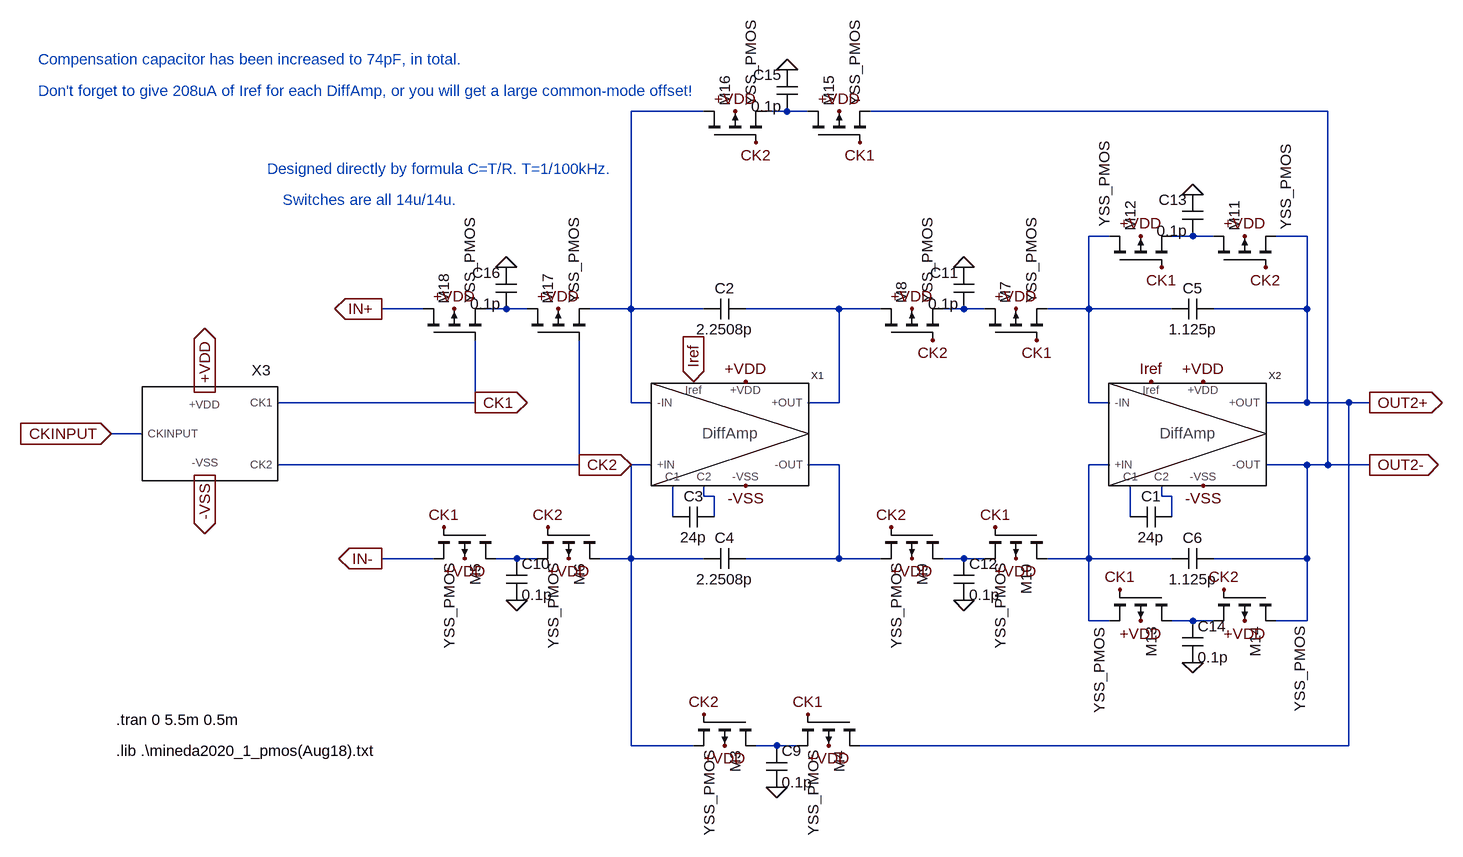
[diagram p0: schematic SCF-Biquad-Final_symbol.asc]
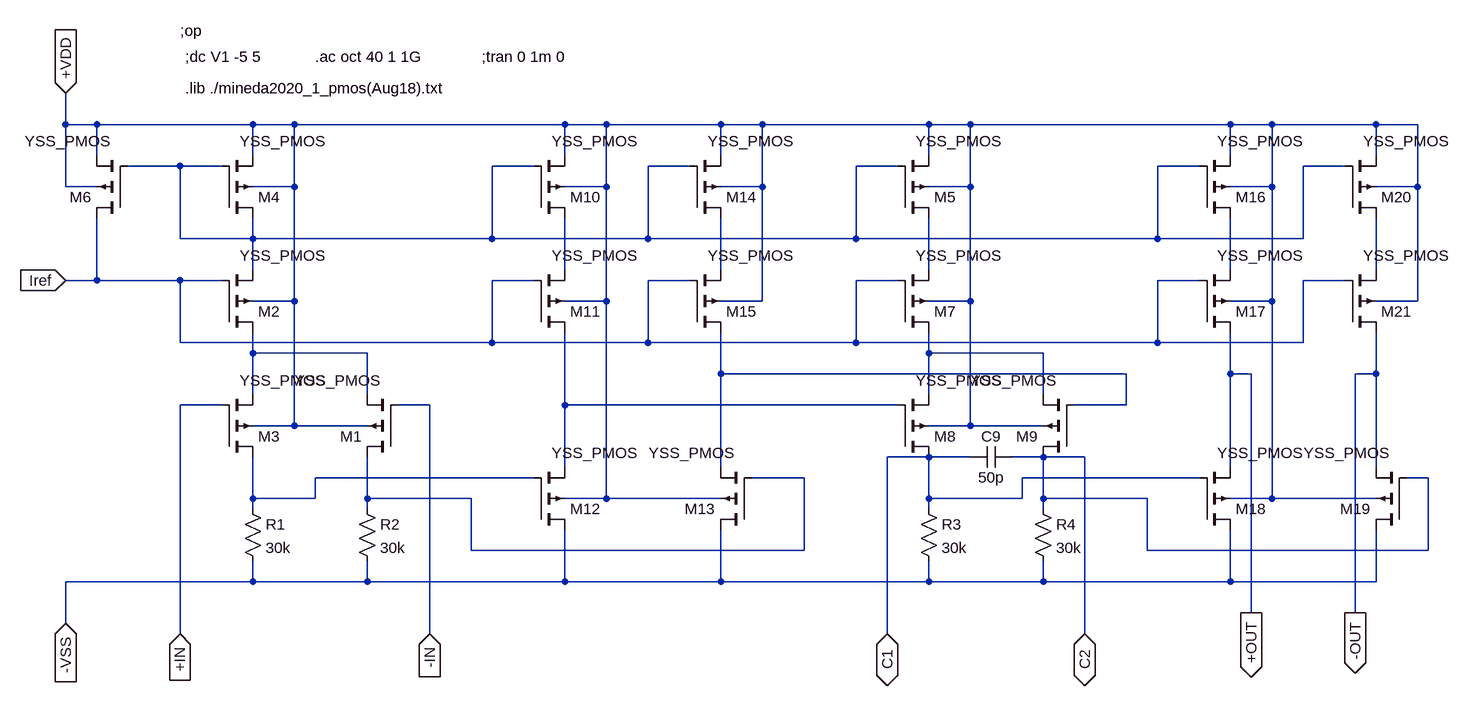
[diagram p1: sub-circuit diffamp.asc]
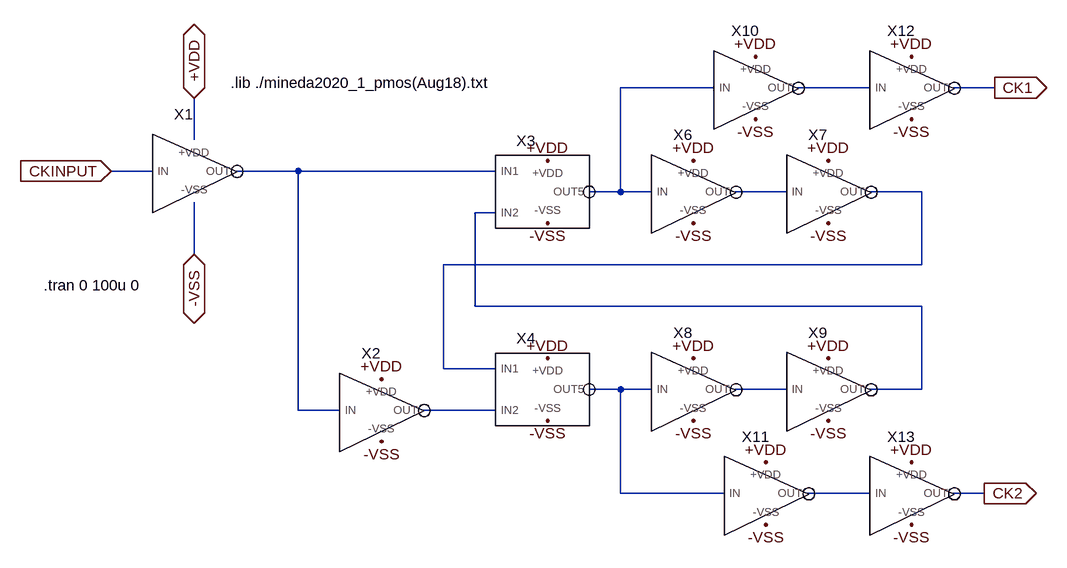
[diagram p2: sub-circuit non-overlapping-ckgen.asc]
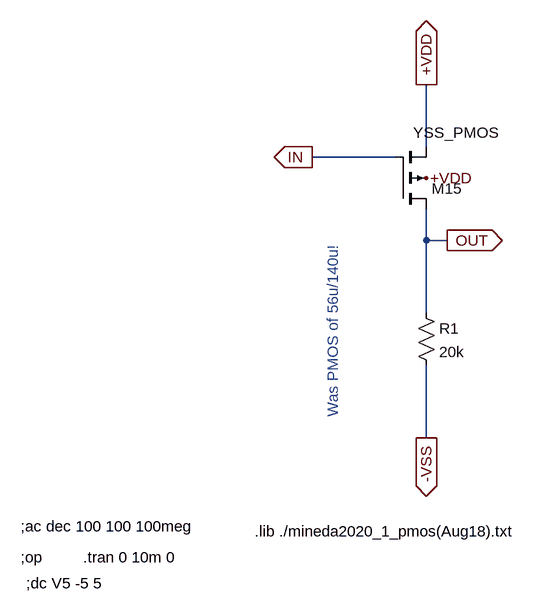
[diagram p3: sub-circuit pmos-inv.asc]
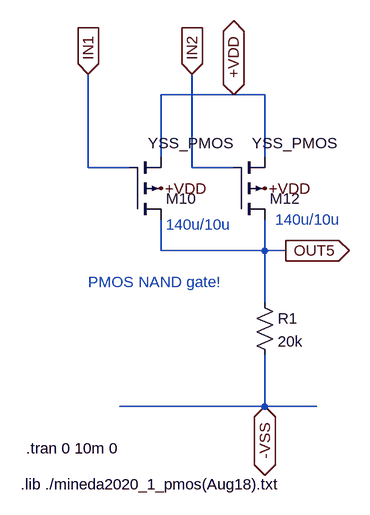
[diagram p4: sub-circuit pmos-nor.asc]
SCF-Biquad-Final_symbol.asc, the LTspice schematic file:
Version 4
SHEET 1 2296 2968
WIRE 576 -976 464 -976
WIRE 704 -976 672 -976
WIRE 736 -976 704 -976
WIRE 1536 -976 832 -976
WIRE 1200 -784 1168 -784
WIRE 1328 -784 1296 -784
WIRE 1360 -784 1328 -784
WIRE 1504 -784 1456 -784
WIRE 144 -672 80 -672
WIRE 272 -672 240 -672
WIRE 304 -672 272 -672
WIRE 464 -672 464 -976
WIRE 464 -672 400 -672
WIRE 576 -672 464 -672
WIRE 784 -672 640 -672
WIRE 848 -672 784 -672
WIRE 976 -672 944 -672
WIRE 1008 -672 976 -672
WIRE 1168 -672 1168 -784
WIRE 1168 -672 1104 -672
WIRE 1296 -672 1168 -672
WIRE 1504 -672 1504 -784
WIRE 1504 -672 1360 -672
WIRE 224 -528 224 -624
WIRE 224 -528 -80 -528
WIRE 464 -528 464 -672
WIRE 496 -528 464 -528
WIRE 784 -528 784 -672
WIRE 784 -528 736 -528
WIRE 1168 -528 1168 -672
WIRE 1200 -528 1168 -528
WIRE 1504 -528 1504 -672
WIRE 1504 -528 1440 -528
WIRE 1568 -528 1504 -528
WIRE 1600 -528 1568 -528
WIRE -288 -480 -336 -480
WIRE 384 -432 384 -624
WIRE 384 -432 -80 -432
WIRE 496 -432 464 -432
WIRE 784 -432 736 -432
WIRE 1200 -432 1168 -432
WIRE 1504 -432 1440 -432
WIRE 1536 -432 1536 -976
WIRE 1536 -432 1504 -432
WIRE 1600 -432 1536 -432
WIRE 576 -384 576 -400
WIRE 592 -384 576 -384
WIRE 1280 -384 1280 -400
WIRE 1296 -384 1280 -384
WIRE 528 -352 528 -400
WIRE 592 -352 592 -384
WIRE 1232 -352 1232 -400
WIRE 1296 -352 1296 -384
WIRE 160 -288 80 -288
WIRE 288 -288 256 -288
WIRE 320 -288 288 -288
WIRE 464 -288 464 -432
WIRE 464 -288 416 -288
WIRE 576 -288 464 -288
WIRE 784 -288 784 -432
WIRE 784 -288 640 -288
WIRE 848 -288 784 -288
WIRE 976 -288 944 -288
WIRE 1008 -288 976 -288
WIRE 1168 -288 1168 -432
WIRE 1168 -288 1104 -288
WIRE 1296 -288 1168 -288
WIRE 1504 -288 1504 -432
WIRE 1504 -288 1360 -288
WIRE 1168 -192 1168 -288
WIRE 1200 -192 1168 -192
WIRE 1328 -192 1296 -192
WIRE 1360 -192 1328 -192
WIRE 1504 -192 1504 -288
WIRE 1504 -192 1456 -192
WIRE 464 0 464 -288
WIRE 560 0 464 0
WIRE 688 0 656 0
WIRE 720 0 688 0
WIRE 1568 0 1568 -528
WIRE 1568 0 816 0
FLAG 640 -560 +VDD
FLAG 640 -400 -VSS
FLAG 560 -560 Iref
IOPIN 560 -560 In
FLAG 1344 -560 +VDD
FLAG 1344 -400 -VSS
FLAG 1264 -560 Iref
FLAG 1600 -528 OUT2+
IOPIN 1600 -528 Out
FLAG 1600 -432 OUT2-
IOPIN 1600 -432 Out
FLAG 688 64 0
FLAG 608 0 +VDD
FLAG 768 0 +VDD
FLAG 576 -48 CK2
FLAG 736 -48 CK1
FLAG 288 -224 0
FLAG 208 -288 +VDD
FLAG 368 -288 +VDD
FLAG 176 -336 CK1
FLAG 336 -336 CK2
FLAG 976 -736 0
FLAG 1056 -672 +VDD
FLAG 896 -672 +VDD
FLAG 1088 -624 CK1
FLAG 928 -624 CK2
FLAG 976 -224 0
FLAG 896 -288 +VDD
FLAG 1056 -288 +VDD
FLAG 864 -336 CK2
FLAG 1024 -336 CK1
FLAG 1328 -848 0
FLAG 1408 -784 +VDD
FLAG 1248 -784 +VDD
FLAG 1440 -736 CK2
FLAG 1280 -736 CK1
FLAG 1328 -128 0
FLAG 1248 -192 +VDD
FLAG 1408 -192 +VDD
FLAG 1216 -240 CK1
FLAG 1376 -240 CK2
FLAG 704 -1040 0
FLAG 784 -976 +VDD
FLAG 624 -976 +VDD
FLAG 816 -928 CK1
FLAG 656 -928 CK2
FLAG 272 -736 0
FLAG 352 -672 +VDD
FLAG 192 -672 +VDD
FLAG 384 -432 CK2
IOPIN 384 -432 Out
FLAG 224 -528 CK1
IOPIN 224 -528 Out
FLAG 80 -672 IN+
IOPIN 80 -672 Out
FLAG 80 -288 IN-
IOPIN 80 -288 Out
FLAG -192 -544 +VDD
IOPIN -192 -544 Out
FLAG -192 -416 -VSS
IOPIN -192 -416 Out
FLAG -336 -480 CKINPUT
IOPIN -336 -480 In
SYMBOL cap 592 -368 R90
WINDOW 0 0 32 VBottom 2
WINDOW 3 32 32 VTop 2
SYMATTR InstName C3
SYMATTR Value 24p
SYMBOL DiffAmp 560 -480 R0
SYMATTR InstName X1
SYMBOL cap 1296 -368 R90
WINDOW 0 0 32 VBottom 2
WINDOW 3 32 32 VTop 2
SYMATTR InstName C1
SYMATTR Value 24p
SYMBOL DiffAmp 1264 -480 R0
SYMATTR InstName X2
SYMBOL cap 640 -688 R90
WINDOW 0 0 32 VBottom 2
WINDOW 3 32 32 VTop 2
SYMATTR InstName C2
SYMATTR Value 2.2508p
SYMBOL cap 640 -304 R90
WINDOW 0 0 32 VBottom 2
WINDOW 3 32 32 VTop 2
SYMATTR InstName C4
SYMATTR Value 2.2508p
SYMBOL cap 1360 -688 R90
WINDOW 0 0 32 VBottom 2
WINDOW 3 32 32 VTop 2
SYMATTR InstName C5
SYMATTR Value 1.125p
SYMBOL cap 1360 -304 R90
WINDOW 0 0 32 VBottom 2
WINDOW 3 32 32 VTop 2
SYMATTR InstName C6
SYMATTR Value 1.125p
SYMBOL pmos4 656 -48 R90
SYMATTR InstName M3
SYMATTR Value YSS_PMOS
SYMATTR Value2 l=14u w=14u
SYMBOL pmos4 816 -48 R90
SYMATTR InstName M4
SYMATTR Value YSS_PMOS
SYMATTR Value2 l=14u w=14u
SYMBOL cap 672 0 R0
SYMATTR InstName C9
SYMATTR Value 0.1p
SYMBOL pmos4 256 -336 R90
SYMATTR InstName M5
SYMATTR Value YSS_PMOS
SYMATTR Value2 l=14u w=14u
SYMBOL pmos4 416 -336 R90
SYMATTR InstName M6
SYMATTR Value YSS_PMOS
SYMATTR Value2 l=14u w=14u
SYMBOL cap 272 -288 R0
SYMATTR InstName C10
SYMATTR Value 0.1p
SYMBOL pmos4 1008 -624 R270
SYMATTR InstName M7
SYMATTR Value YSS_PMOS
SYMATTR Value2 l=14u w=14u
SYMBOL pmos4 848 -624 R270
SYMATTR InstName M8
SYMATTR Value YSS_PMOS
SYMATTR Value2 l=14u w=14u
SYMBOL cap 992 -672 R180
WINDOW 0 24 56 Left 2
WINDOW 3 24 8 Left 2
SYMATTR InstName C11
SYMATTR Value 0.1p
SYMBOL pmos4 944 -336 R90
SYMATTR InstName M9
SYMATTR Value YSS_PMOS
SYMATTR Value2 l=14u w=14u
SYMBOL pmos4 1104 -336 R90
SYMATTR InstName M10
SYMATTR Value YSS_PMOS
SYMATTR Value2 l=14u w=14u
SYMBOL cap 960 -288 R0
SYMATTR InstName C12
SYMATTR Value 0.1p
SYMBOL pmos4 1360 -736 R270
WINDOW 3 57 111 Left 2
SYMATTR Value YSS_PMOS
SYMATTR InstName M11
SYMATTR Value2 l=14u w=14u
SYMBOL pmos4 1200 -736 R270
WINDOW 3 62 -8 Left 2
SYMATTR Value YSS_PMOS
SYMATTR InstName M12
SYMATTR Value2 l=14u w=14u
SYMBOL cap 1344 -784 R180
WINDOW 0 24 56 Left 2
WINDOW 3 24 8 Left 2
SYMATTR InstName C13
SYMATTR Value 0.1p
SYMBOL pmos4 1296 -240 R90
WINDOW 3 59 112 Left 2
SYMATTR Value YSS_PMOS
SYMATTR InstName M13
SYMATTR Value2 l=14u w=14u
SYMBOL pmos4 1456 -240 R90
WINDOW 3 57 -37 Left 2
SYMATTR Value YSS_PMOS
SYMATTR InstName M14
SYMATTR Value2 l=14u w=14u
SYMBOL cap 1312 -192 R0
SYMATTR InstName C14
SYMATTR Value 0.1p
SYMBOL pmos4 736 -928 R270
SYMATTR InstName M15
SYMATTR Value YSS_PMOS
SYMATTR Value2 l=14u w=14u
SYMBOL pmos4 576 -928 R270
SYMATTR InstName M16
SYMATTR Value YSS_PMOS
SYMATTR Value2 l=14u w=14u
SYMBOL cap 720 -976 R180
WINDOW 0 24 56 Left 2
WINDOW 3 24 8 Left 2
SYMATTR InstName C15
SYMATTR Value 0.1p
SYMBOL pmos4 304 -624 R270
SYMATTR InstName M17
SYMATTR Value YSS_PMOS
SYMATTR Value2 l=14u w=14u
SYMBOL pmos4 144 -624 R270
SYMATTR InstName M18
SYMATTR Value YSS_PMOS
SYMATTR Value2 l=14u w=14u
SYMBOL cap 288 -672 R180
WINDOW 0 24 56 Left 2
WINDOW 3 24 8 Left 2
SYMATTR InstName C16
SYMATTR Value 0.1p
SYMBOL Non-overlapping-CKGen -192 -480 R0
SYMATTR InstName X3
TEXT -328 8 Left 2 !.lib .\\mineda2020_1_pmos(Aug18).txt
TEXT -328 -40 Left 2 !.tran 0 5.5m 0.5m
TEXT -448 -1056 Left 2 ;Compensation capacitor has been increased to 74pF, in total.
TEXT -448 -1008 Left 2 ;Don't forget to give 208uA of Iref for each DiffAmp, or you will get a large common-mode offset!
TEXT -96 -888 Left 2 ;Designed directly by formula C=T/R. T=1/100kHz.
TEXT -72 -840 Left 2 ;Switches are all 14u/14u.

diffamp.asc, the sub-circuit schematic file:
Version 4
SHEET 1 2296 2968
WIRE -384 -864 -384 -912
WIRE -336 -864 -384 -864
WIRE -96 -864 -336 -864
WIRE -32 -864 -96 -864
WIRE 384 -864 -32 -864
WIRE 448 -864 384 -864
WIRE 624 -864 448 -864
WIRE 688 -864 624 -864
WIRE 944 -864 688 -864
WIRE 1008 -864 944 -864
WIRE 1408 -864 1008 -864
WIRE 1472 -864 1408 -864
WIRE 1632 -864 1472 -864
WIRE 1696 -864 1632 -864
WIRE -336 -816 -336 -864
WIRE -96 -816 -96 -864
WIRE 384 -816 384 -864
WIRE 624 -816 624 -864
WIRE 944 -816 944 -864
WIRE 1408 -816 1408 -864
WIRE 1632 -816 1632 -864
WIRE -208 -800 -288 -800
WIRE -144 -800 -208 -800
WIRE 336 -800 272 -800
WIRE 576 -800 512 -800
WIRE 896 -800 832 -800
WIRE 1360 -800 1296 -800
WIRE 1584 -800 1520 -800
WIRE -384 -768 -384 -864
WIRE -336 -768 -384 -768
WIRE -32 -768 -32 -864
WIRE -32 -768 -96 -768
WIRE 448 -768 448 -864
WIRE 448 -768 384 -768
WIRE 688 -768 688 -864
WIRE 688 -768 624 -768
WIRE 1008 -768 1008 -864
WIRE 1008 -768 944 -768
WIRE 1472 -768 1472 -864
WIRE 1472 -768 1408 -768
WIRE 1696 -768 1696 -864
WIRE 1696 -768 1632 -768
WIRE -208 -688 -208 -800
WIRE -96 -688 -96 -720
WIRE -96 -688 -208 -688
WIRE 272 -688 272 -800
WIRE 272 -688 -96 -688
WIRE 512 -688 512 -800
WIRE 512 -688 272 -688
WIRE 832 -688 832 -800
WIRE 832 -688 512 -688
WIRE 1296 -688 1296 -800
WIRE 1296 -688 832 -688
WIRE 1520 -688 1520 -800
WIRE 1520 -688 1296 -688
WIRE -96 -640 -96 -688
WIRE 384 -640 384 -720
WIRE 624 -640 624 -720
WIRE 944 -640 944 -720
WIRE 1408 -640 1408 -720
WIRE 1632 -640 1632 -720
WIRE -336 -624 -336 -720
WIRE -336 -624 -384 -624
WIRE -208 -624 -336 -624
WIRE -144 -624 -208 -624
WIRE 336 -624 272 -624
WIRE 576 -624 512 -624
WIRE 896 -624 832 -624
WIRE 1360 -624 1296 -624
WIRE 1584 -624 1520 -624
WIRE -32 -592 -32 -768
WIRE -32 -592 -96 -592
WIRE 448 -592 448 -768
WIRE 448 -592 384 -592
WIRE 688 -592 688 -768
WIRE 688 -592 624 -592
WIRE 1008 -592 1008 -768
WIRE 1008 -592 944 -592
WIRE 1472 -592 1472 -768
WIRE 1472 -592 1408 -592
WIRE 1696 -592 1696 -768
WIRE 1696 -592 1632 -592
WIRE -208 -528 -208 -624
WIRE 272 -528 272 -624
WIRE 272 -528 -208 -528
WIRE 512 -528 512 -624
WIRE 512 -528 272 -528
WIRE 832 -528 832 -624
WIRE 832 -528 512 -528
WIRE 1296 -528 1296 -624
WIRE 1296 -528 832 -528
WIRE 1520 -528 1520 -624
WIRE 1520 -528 1296 -528
WIRE -96 -512 -96 -544
WIRE 80 -512 -96 -512
WIRE 944 -512 944 -544
WIRE 1120 -512 944 -512
WIRE 624 -480 624 -544
WIRE 1248 -480 624 -480
WIRE 1408 -480 1408 -544
WIRE 1440 -480 1408 -480
WIRE 1632 -480 1632 -544
WIRE 1632 -480 1600 -480
WIRE -96 -448 -96 -512
WIRE 80 -448 80 -512
WIRE 944 -448 944 -512
WIRE 1120 -448 1120 -512
WIRE -144 -432 -208 -432
WIRE 176 -432 128 -432
WIRE 384 -432 384 -544
WIRE 896 -432 384 -432
WIRE 1248 -432 1248 -480
WIRE 1248 -432 1168 -432
WIRE -32 -400 -32 -592
WIRE -32 -400 -96 -400
WIRE 80 -400 -32 -400
WIRE 1008 -400 1008 -592
WIRE 1008 -400 944 -400
WIRE 1120 -400 1008 -400
WIRE 944 -352 880 -352
WIRE 1008 -352 944 -352
WIRE 1120 -352 1072 -352
WIRE 1184 -352 1120 -352
WIRE 384 -336 384 -432
WIRE 624 -336 624 -480
WIRE 1408 -336 1408 -480
WIRE 1632 -336 1632 -480
WIRE 336 -320 0 -320
WIRE 752 -320 672 -320
WIRE 1360 -320 1088 -320
WIRE 1712 -320 1680 -320
WIRE -96 -288 -96 -352
WIRE 0 -288 0 -320
WIRE 0 -288 -96 -288
WIRE 80 -288 80 -352
WIRE 240 -288 80 -288
WIRE 448 -288 448 -592
WIRE 448 -288 384 -288
WIRE 624 -288 448 -288
WIRE 944 -288 944 -352
WIRE 1088 -288 1088 -320
WIRE 1088 -288 944 -288
WIRE 1120 -288 1120 -352
WIRE 1280 -288 1120 -288
WIRE 1472 -288 1472 -592
WIRE 1472 -288 1408 -288
WIRE 1632 -288 1472 -288
WIRE -96 -272 -96 -288
WIRE 80 -272 80 -288
WIRE 944 -272 944 -288
WIRE 1120 -272 1120 -288
WIRE 240 -208 240 -288
WIRE 752 -208 752 -320
WIRE 752 -208 240 -208
WIRE 1280 -208 1280 -288
WIRE 1712 -208 1712 -320
WIRE 1712 -208 1280 -208
WIRE -96 -160 -96 -192
WIRE -96 -160 -384 -160
WIRE 80 -160 80 -192
WIRE 80 -160 -96 -160
WIRE 384 -160 384 -240
WIRE 384 -160 80 -160
WIRE 624 -160 624 -240
WIRE 624 -160 384 -160
WIRE 944 -160 944 -192
WIRE 944 -160 624 -160
WIRE 1120 -160 1120 -192
WIRE 1120 -160 944 -160
WIRE 1408 -160 1408 -240
WIRE 1408 -160 1120 -160
WIRE 1632 -160 1632 -240
WIRE 1632 -160 1408 -160
WIRE 1440 -112 1440 -480
WIRE 1600 -112 1600 -480
WIRE -384 -96 -384 -160
WIRE -208 -80 -208 -432
WIRE 176 -80 176 -432
WIRE 880 -80 880 -352
WIRE 1184 -80 1184 -352
FLAG 1600 -112 -OUT
IOPIN 1600 -112 Out
FLAG 1440 -112 +OUT
IOPIN 1440 -112 Out
FLAG -384 -912 +VDD
IOPIN -384 -912 In
FLAG -384 -96 -VSS
IOPIN -384 -96 In
FLAG -384 -624 Iref
IOPIN -384 -624 In
FLAG -208 -80 +IN
IOPIN -208 -80 In
FLAG 176 -80 -IN
IOPIN 176 -80 In
FLAG 880 -80 C1
IOPIN 880 -80 BiDir
FLAG 1184 -80 C2
IOPIN 1184 -80 BiDir
SYMBOL pmos4 -288 -720 R180
WINDOW 3 28 118 Left 2
SYMATTR Value YSS_PMOS
SYMATTR InstName M6
SYMATTR Value2 l=14u w=280u ad=3.92n as=3.92n pd=308u ps=308u
SYMBOL pmos4 -144 -544 M180
WINDOW 3 28 118 Left 2
SYMATTR Value YSS_PMOS
SYMATTR InstName M2
SYMATTR Value2 l=14u w=84u ad=1.176n as=1.176n pd=112u ps=112u
SYMBOL pmos4 -144 -352 M180
WINDOW 3 28 118 Left 2
SYMATTR Value YSS_PMOS
SYMATTR InstName M3
SYMATTR Value2 l=10u w=200u ad=2.0n as=2.0n pd=220u ps=220u
SYMBOL res -112 -288 R0
SYMATTR InstName R1
SYMATTR Value 30k
SYMBOL res 64 -288 R0
SYMATTR InstName R2
SYMATTR Value 30k
SYMBOL res 928 -288 R0
SYMATTR InstName R3
SYMATTR Value 30k
SYMBOL res 1104 -288 R0
SYMATTR InstName R4
SYMATTR Value 30k
SYMBOL pmos4 -144 -720 M180
WINDOW 3 28 118 Left 2
SYMATTR Value YSS_PMOS
SYMATTR InstName M4
SYMATTR Value2 l=14u w=280u ad=3.92n as=3.92n pd=308u ps=308u
SYMBOL pmos4 896 -720 M180
WINDOW 3 28 118 Left 2
SYMATTR Value YSS_PMOS
SYMATTR InstName M5
SYMATTR Value2 l=14u w=280u ad=3.92n as=3.92n pd=308u ps=308u
SYMBOL pmos4 896 -544 M180
WINDOW 3 28 118 Left 2
SYMATTR Value YSS_PMOS
SYMATTR InstName M7
SYMATTR Value2 l=14u w=84u ad=1.176n as=1.176n pd=112u ps=112u
SYMBOL pmos4 896 -352 M180
WINDOW 3 28 118 Left 2
SYMATTR Value YSS_PMOS
SYMATTR InstName M8
SYMATTR Value2 l=10u w=200u ad=2.0n as=2.0n pd=220u ps=220u
SYMBOL pmos4 128 -352 R180
WINDOW 3 28 118 Left 2
SYMATTR Value YSS_PMOS
SYMATTR InstName M1
SYMATTR Value2 l=10u w=200u ad=2.0n as=2.0n pd=220u ps=220u
SYMBOL pmos4 1168 -352 R180
WINDOW 3 28 118 Left 2
SYMATTR Value YSS_PMOS
SYMATTR InstName M9
SYMATTR Value2 l=10u w=200u ad=2.0n as=2.0n pd=220u ps=220u
SYMBOL pmos4 336 -720 M180
WINDOW 3 28 118 Left 2
SYMATTR Value YSS_PMOS
SYMATTR InstName M10
SYMATTR Value2 l=14u w=280u ad=3.92n as=3.92n pd=308u ps=308u
SYMBOL pmos4 336 -544 M180
WINDOW 3 28 118 Left 2
SYMATTR Value YSS_PMOS
SYMATTR InstName M11
SYMATTR Value2 l=14u w=84u ad=1.176n as=1.176n pd=112u ps=112u
SYMBOL pmos4 336 -240 M180
WINDOW 3 28 118 Left 2
SYMATTR Value YSS_PMOS
SYMATTR InstName M12
SYMATTR Value2 l=10u w=200u ad=2.0n as=2.0n pd=220u ps=220u
SYMBOL pmos4 672 -240 R180
WINDOW 3 28 118 Left 2
SYMATTR Value YSS_PMOS
SYMATTR InstName M13
SYMATTR Value2 l=10u w=200u ad=2.0n as=2.0n pd=220u ps=220u
SYMBOL pmos4 576 -720 M180
WINDOW 3 28 118 Left 2
SYMATTR Value YSS_PMOS
SYMATTR InstName M14
SYMATTR Value2 l=14u w=280u ad=3.92n as=3.92n pd=308u ps=308u
SYMBOL pmos4 576 -544 M180
WINDOW 3 28 118 Left 2
SYMATTR Value YSS_PMOS
SYMATTR InstName M15
SYMATTR Value2 l=14u w=84u ad=1.176n as=1.176n pd=112u ps=112u
SYMBOL pmos4 1360 -720 M180
WINDOW 3 28 118 Left 2
SYMATTR Value YSS_PMOS
SYMATTR InstName M16
SYMATTR Value2 l=14u w=280u ad=3.92n as=3.92n pd=308u ps=308u m=4
SYMBOL pmos4 1360 -544 M180
WINDOW 3 28 118 Left 2
SYMATTR Value YSS_PMOS
SYMATTR InstName M17
SYMATTR Value2 l=14u w=84u ad=1.176n as=1.176n pd=112u ps=112u m=4
SYMBOL pmos4 1360 -240 M180
WINDOW 3 28 118 Left 2
SYMATTR Value YSS_PMOS
SYMATTR InstName M18
SYMATTR Value2 l=10u w=200u ad=2.0n as=2.0n pd=220u ps=220u m=4
SYMBOL pmos4 1680 -240 R180
WINDOW 3 28 118 Left 2
SYMATTR Value YSS_PMOS
SYMATTR InstName M19
SYMATTR Value2 l=10u w=200u ad=2.0n as=2.0n pd=220u ps=220u m=4
SYMBOL pmos4 1584 -720 M180
WINDOW 3 28 118 Left 2
SYMATTR Value YSS_PMOS
SYMATTR InstName M20
SYMATTR Value2 l=14u w=280u ad=3.92n as=3.92n pd=308u ps=308u m=4
SYMBOL pmos4 1584 -544 M180
WINDOW 3 28 118 Left 2
SYMATTR Value YSS_PMOS
SYMATTR InstName M21
SYMATTR Value2 l=14u w=84u ad=1.176n as=1.176n pd=112u ps=112u m=4
SYMBOL cap 1072 -368 R90
WINDOW 0 0 32 VBottom 2
WINDOW 3 32 32 VTop 2
SYMATTR InstName C9
SYMATTR Value 50p
TEXT -200 -968 Left 2 !;dc V1 -5 5
TEXT -200 -920 Left 2 !.lib ./mineda2020_1_pmos(Aug18).txt
TEXT -208 -1008 Left 2 !;op
TEXT 0 -968 Left 2 !.ac oct 40 1 1G
TEXT 256 -968 Left 2 !;tran 0 1m 0

non-overlapping-ckgen.asc, the sub-circuit schematic file:
Version 4
SHEET 1 1876 1032
WIRE 1120 16 976 16
WIRE 1360 16 1248 16
WIRE 1552 16 1488 16
WIRE 320 96 320 32
WIRE 256 144 192 144
WIRE 480 144 384 144
WIRE 784 144 480 144
WIRE 976 176 976 16
WIRE 976 176 928 176
WIRE 1024 176 976 176
WIRE 1232 176 1152 176
WIRE 1440 176 1360 176
WIRE 784 208 752 208
WIRE 320 272 320 192
WIRE 1440 288 1440 176
WIRE 1440 288 704 288
WIRE 752 352 752 208
WIRE 1440 352 752 352
WIRE 704 448 704 288
WIRE 784 448 704 448
WIRE 976 480 928 480
WIRE 1024 480 976 480
WIRE 1232 480 1152 480
WIRE 1440 480 1440 352
WIRE 1440 480 1360 480
WIRE 480 512 480 144
WIRE 544 512 480 512
WIRE 784 512 672 512
WIRE 976 640 976 480
WIRE 1136 640 976 640
WIRE 1360 640 1264 640
WIRE 1536 640 1488 640
FLAG 608 464 +VDD
FLAG 608 560 -VSS
FLAG 864 128 +VDD
FLAG 864 432 +VDD
FLAG 864 224 -VSS
FLAG 864 528 -VSS
FLAG 1088 128 +VDD
FLAG 1088 224 -VSS
FLAG 1296 128 +VDD
FLAG 1296 224 -VSS
FLAG 1088 432 +VDD
FLAG 1088 528 -VSS
FLAG 1296 432 +VDD
FLAG 1296 528 -VSS
FLAG 1552 16 CK1
IOPIN 1552 16 Out
FLAG 1536 640 CK2
IOPIN 1536 640 Out
FLAG 1184 -32 +VDD
FLAG 1184 64 -VSS
FLAG 1200 592 +VDD
FLAG 1200 688 -VSS
FLAG 1424 -32 +VDD
FLAG 1424 64 -VSS
FLAG 1424 592 +VDD
FLAG 1424 688 -VSS
FLAG 192 144 CKINPUT
IOPIN 192 144 In
FLAG 320 32 +VDD
IOPIN 320 32 BiDir
FLAG 320 272 -VSS
IOPIN 320 272 BiDir
SYMBOL PMOS-INV 304 144 R0
SYMATTR InstName X1
SYMBOL PMOS-INV 592 512 R0
SYMATTR InstName X2
SYMBOL PMOS-NOR 848 176 R0
SYMATTR InstName X3
SYMBOL PMOS-NOR 848 480 R0
SYMATTR InstName X4
SYMBOL PMOS-INV 1072 176 R0
SYMATTR InstName X6
SYMBOL PMOS-INV 1280 176 R0
SYMATTR InstName X7
SYMBOL PMOS-INV 1072 480 R0
SYMATTR InstName X8
SYMBOL PMOS-INV 1280 480 R0
SYMATTR InstName X9
SYMBOL PMOS-INV 1168 16 R0
SYMATTR InstName X10
SYMBOL PMOS-INV 1184 640 R0
SYMATTR InstName X11
SYMBOL PMOS-INV 1408 16 R0
SYMATTR InstName X12
SYMBOL PMOS-INV 1408 640 R0
SYMATTR InstName X13
TEXT 88 320 Left 2 !.tran 0 100u 0
TEXT 376 8 Left 2 !.lib ./mineda2020_1_pmos(Aug18).txt

pmos-inv.asc, the sub-circuit schematic file:
Version 4
SHEET 1 2296 2968
WIRE 640 -864 640 -960
WIRE 592 -848 464 -848
WIRE 640 -720 640 -768
WIRE 672 -720 640 -720
WIRE 640 -608 640 -720
WIRE 640 -416 640 -528
FLAG 640 -960 +VDD
IOPIN 640 -960 Out
FLAG 640 -416 -VSS
IOPIN 640 -416 Out
FLAG 640 -816 +VDD
FLAG 672 -720 OUT
IOPIN 672 -720 Out
FLAG 464 -848 IN
IOPIN 464 -848 Out
SYMBOL pmos4 592 -768 M180
WINDOW 3 28 118 Left 2
SYMATTR Value YSS_PMOS
SYMATTR InstName M15
SYMATTR Value2 l=10u w=140u ad=1.96n as=1.96n pd=168u ps=168u
SYMBOL res 624 -624 R0
SYMATTR InstName R1
SYMATTR Value 20k
TEXT 24 -192 Left 2 !;dc V5 -5 5
TEXT 376 -272 Left 2 !.lib ./mineda2020_1_pmos(Aug18).txt
TEXT 16 -232 Left 2 !;op
TEXT 16 -280 Left 2 !;ac dec 100 100 100meg
TEXT 112 -232 Left 2 !.tran 0 10m 0
TEXT 496 -448 VLeft 2 ;Was PMOS of 56u/140u!

pmos-nor.asc, the sub-circuit schematic file:
Version 4
SHEET 1 2296 2968
WIRE 976 -912 864 -912
WIRE 1024 -912 976 -912
WIRE 864 -816 864 -912
WIRE 1024 -816 1024 -912
WIRE 752 -800 752 -944
WIRE 816 -800 752 -800
WIRE 912 -800 912 -944
WIRE 976 -800 912 -800
WIRE 864 -672 864 -720
WIRE 1024 -672 1024 -720
WIRE 1024 -672 864 -672
WIRE 1056 -672 1024 -672
WIRE 1024 -592 1024 -672
WIRE 1024 -432 1024 -512
WIRE 1024 -432 800 -432
WIRE 1104 -432 1024 -432
FLAG 1024 -432 -VSS
IOPIN 1024 -432 BiDir
FLAG 1056 -672 OUT5
IOPIN 1056 -672 Out
FLAG 864 -768 +VDD
FLAG 1024 -768 +VDD
FLAG 912 -944 IN2
IOPIN 912 -944 In
FLAG 752 -944 IN1
IOPIN 752 -944 In
FLAG 976 -912 +VDD
IOPIN 976 -912 BiDir
SYMBOL pmos4 816 -720 M180
WINDOW 3 28 118 Left 2
SYMATTR Value YSS_PMOS
SYMATTR InstName M10
SYMATTR Value2 l=10u w=140u ad=0.994n as=0.994n pd=98u ps=98u
SYMBOL pmos4 976 -720 M180
WINDOW 3 28 118 Left 2
SYMATTR Value YSS_PMOS
SYMATTR InstName M12
SYMATTR Value2 l=10u w=140u ad=0.994n as=0.994n pd=98u ps=98u
SYMBOL res 1008 -608 R0
SYMATTR InstName R1
SYMATTR Value 20k
TEXT 648 -312 Left 2 !.lib ./mineda2020_1_pmos(Aug18).txt
TEXT 656 -368 Left 2 !.tran 0 10m 0
TEXT 1040 -720 Left 2 ;140u/10u
TEXT 872 -712 Left 2 ;140u/10u
TEXT 752 -624 Left 2 ;PMOS NAND gate!

The netlist it stands for:
* SCF-Biquad-Final_symbol.asc
C3 N011 N013 24p
XX1 N008 N001 N009 N006 +VDD -VSS N013 N011 Iref diffamp
C1 N012 N014 24p
XX2 N010 N003 OUT2- OUT2+ +VDD -VSS N014 N012 Iref diffamp
C2 N006 N001 2.2508p
C4 N009 N008 2.2508p
C5 OUT2+ N003 1.125p
C6 OUT2- N010 1.125p
M3 N018 CK2 N008 +VDD YSS_PMOS l=14u w=14u
M4 OUT2+ CK1 N018 +VDD YSS_PMOS l=14u w=14u
C9 N018 0 0.1p
M5 N015 CK1 IN- +VDD YSS_PMOS l=14u w=14u
M6 N008 CK2 N015 +VDD YSS_PMOS l=14u w=14u
C10 N015 0 0.1p
M7 N007 CK1 N003 +VDD YSS_PMOS l=14u w=14u
M8 N006 CK2 N007 +VDD YSS_PMOS l=14u w=14u
C11 N007 0 0.1p
M9 N016 CK2 N009 +VDD YSS_PMOS l=14u w=14u
M10 N010 CK1 N016 +VDD YSS_PMOS l=14u w=14u
C12 N016 0 0.1p
M11 N004 CK2 OUT2+ +VDD YSS_PMOS l=14u w=14u
M12 N003 CK1 N004 +VDD YSS_PMOS l=14u w=14u
C13 N004 0 0.1p
M13 N017 CK1 N010 +VDD YSS_PMOS l=14u w=14u
M14 OUT2- CK2 N017 +VDD YSS_PMOS l=14u w=14u
C14 N017 0 0.1p
M15 N002 CK1 OUT2- +VDD YSS_PMOS l=14u w=14u
M16 N001 CK2 N002 +VDD YSS_PMOS l=14u w=14u
C15 N002 0 0.1p
M17 N005 CK2 N001 +VDD YSS_PMOS l=14u w=14u
M18 IN+ CK1 N005 +VDD YSS_PMOS l=14u w=14u
C16 N005 0 0.1p
XX3 CKINPUT +VDD -VSS CK1 CK2 non-overlapping-ckgen

* block symbol definitions
.subckt diffamp +IN -IN -OUT +OUT +VDD -VSS C1 C2 Iref
M6 Iref N001 +VDD +VDD YSS_PMOS l=14u w=280u ad=3.92n as=3.92n pd=308u ps=308u
M2 N007 Iref N001 +VDD YSS_PMOS l=14u w=84u ad=1.176n as=1.176n pd=112u ps=112u
M3 N011 +IN N007 +VDD YSS_PMOS l=10u w=200u ad=2.0n as=2.0n pd=220u ps=220u
R1 N011 -VSS 30k
R2 N012 -VSS 30k
R3 C1 -VSS 30k
R4 C2 -VSS 30k
M4 N001 N001 +VDD +VDD YSS_PMOS l=14u w=280u ad=3.92n as=3.92n pd=308u ps=308u
M5 N004 N001 +VDD +VDD YSS_PMOS l=14u w=280u ad=3.92n as=3.92n pd=308u ps=308u
M7 N008 Iref N004 +VDD YSS_PMOS l=14u w=84u ad=1.176n as=1.176n pd=112u ps=112u
M8 C1 N010 N008 +VDD YSS_PMOS l=10u w=200u ad=2.0n as=2.0n pd=220u ps=220u
M1 N012 -IN N007 +VDD YSS_PMOS l=10u w=200u ad=2.0n as=2.0n pd=220u ps=220u
M9 C2 N009 N008 +VDD YSS_PMOS l=10u w=200u ad=2.0n as=2.0n pd=220u ps=220u
M10 N002 N001 +VDD +VDD YSS_PMOS l=14u w=280u ad=3.92n as=3.92n pd=308u ps=308u
M11 N010 Iref N002 +VDD YSS_PMOS l=14u w=84u ad=1.176n as=1.176n pd=112u ps=112u
M12 -VSS N011 N010 +VDD YSS_PMOS l=10u w=200u ad=2.0n as=2.0n pd=220u ps=220u
M13 -VSS N012 N009 +VDD YSS_PMOS l=10u w=200u ad=2.0n as=2.0n pd=220u ps=220u
M14 N003 N001 +VDD +VDD YSS_PMOS l=14u w=280u ad=3.92n as=3.92n pd=308u ps=308u
M15 N009 Iref N003 +VDD YSS_PMOS l=14u w=84u ad=1.176n as=1.176n pd=112u ps=112u
M16 N005 N001 +VDD +VDD YSS_PMOS l=14u w=280u ad=3.92n as=3.92n pd=308u ps=308u m=4
M17 +OUT Iref N005 +VDD YSS_PMOS l=14u w=84u ad=1.176n as=1.176n pd=112u ps=112u m=4
M18 -VSS C1 +OUT +VDD YSS_PMOS l=10u w=200u ad=2.0n as=2.0n pd=220u ps=220u m=4
M19 -VSS C2 -OUT +VDD YSS_PMOS l=10u w=200u ad=2.0n as=2.0n pd=220u ps=220u m=4
M20 N006 N001 +VDD +VDD YSS_PMOS l=14u w=280u ad=3.92n as=3.92n pd=308u ps=308u m=4
M21 -OUT Iref N006 +VDD YSS_PMOS l=14u w=84u ad=1.176n as=1.176n pd=112u ps=112u m=4
C9 C2 C1 50p
;dc V1 -5 5
.lib ./mineda2020_1_pmos(Aug18).txt
;op
.ac oct 40 1 1G
;tran 0 1m 0
.ends diffamp

.subckt non-overlapping-ckgen CKINPUT +VDD -VSS CK1 CK2
XX1 +VDD -VSS CKINPUT N003 pmos-inv
XX2 +VDD -VSS N003 N009 pmos-inv
XX3 N003 N006 +VDD -VSS N001 pmos-nor
XX4 N005 N009 +VDD -VSS N007 pmos-nor
XX6 +VDD -VSS N001 N004 pmos-inv
XX7 +VDD -VSS N004 N005 pmos-inv
XX8 +VDD -VSS N007 N008 pmos-inv
XX9 +VDD -VSS N008 N006 pmos-inv
XX10 +VDD -VSS N001 N002 pmos-inv
XX11 +VDD -VSS N007 N010 pmos-inv
XX12 +VDD -VSS N002 CK1 pmos-inv
XX13 +VDD -VSS N010 CK2 pmos-inv
.tran 0 100u 0
.lib ./mineda2020_1_pmos(Aug18).txt
.ends non-overlapping-ckgen

.subckt pmos-inv +VDD -VSS IN OUT
M15 OUT IN +VDD +VDD YSS_PMOS l=10u w=140u ad=1.96n as=1.96n pd=168u ps=168u
R1 OUT -VSS 20k
;dc V5 -5 5
.lib ./mineda2020_1_pmos(Aug18).txt
;op
;ac dec 100 100 100meg
.tran 0 10m 0
* Was PMOS of 56u/140u!
.ends pmos-inv

.subckt pmos-nor IN1 IN2 +VDD -VSS OUT5
M10 OUT5 IN1 +VDD +VDD YSS_PMOS l=10u w=140u ad=0.994n as=0.994n pd=98u ps=98u
M12 OUT5 IN2 +VDD +VDD YSS_PMOS l=10u w=140u ad=0.994n as=0.994n pd=98u ps=98u
R1 OUT5 -VSS 20k
.lib ./mineda2020_1_pmos(Aug18).txt
.tran 0 10m 0
* 140u/10u
* 140u/10u
* PMOS NAND gate!
.ends pmos-nor

.model NMOS NMOS
.model PMOS PMOS
.lib standard.mos
.lib .\mineda2020_1_pmos(Aug18).txt
.tran 0 5.5m 0.5m
* Compensation capacitor has been increased to 74pF, in total.
* Don't forget to give 208uA of Iref for each DiffAmp, or you will get a large common-mode offset!
* Designed directly by formula C=T/R. T=1/100kHz.
* Switches are all 14u/14u.
.backanno
.end